# EAGLE design radio_module (EAGLE 6.5.0)
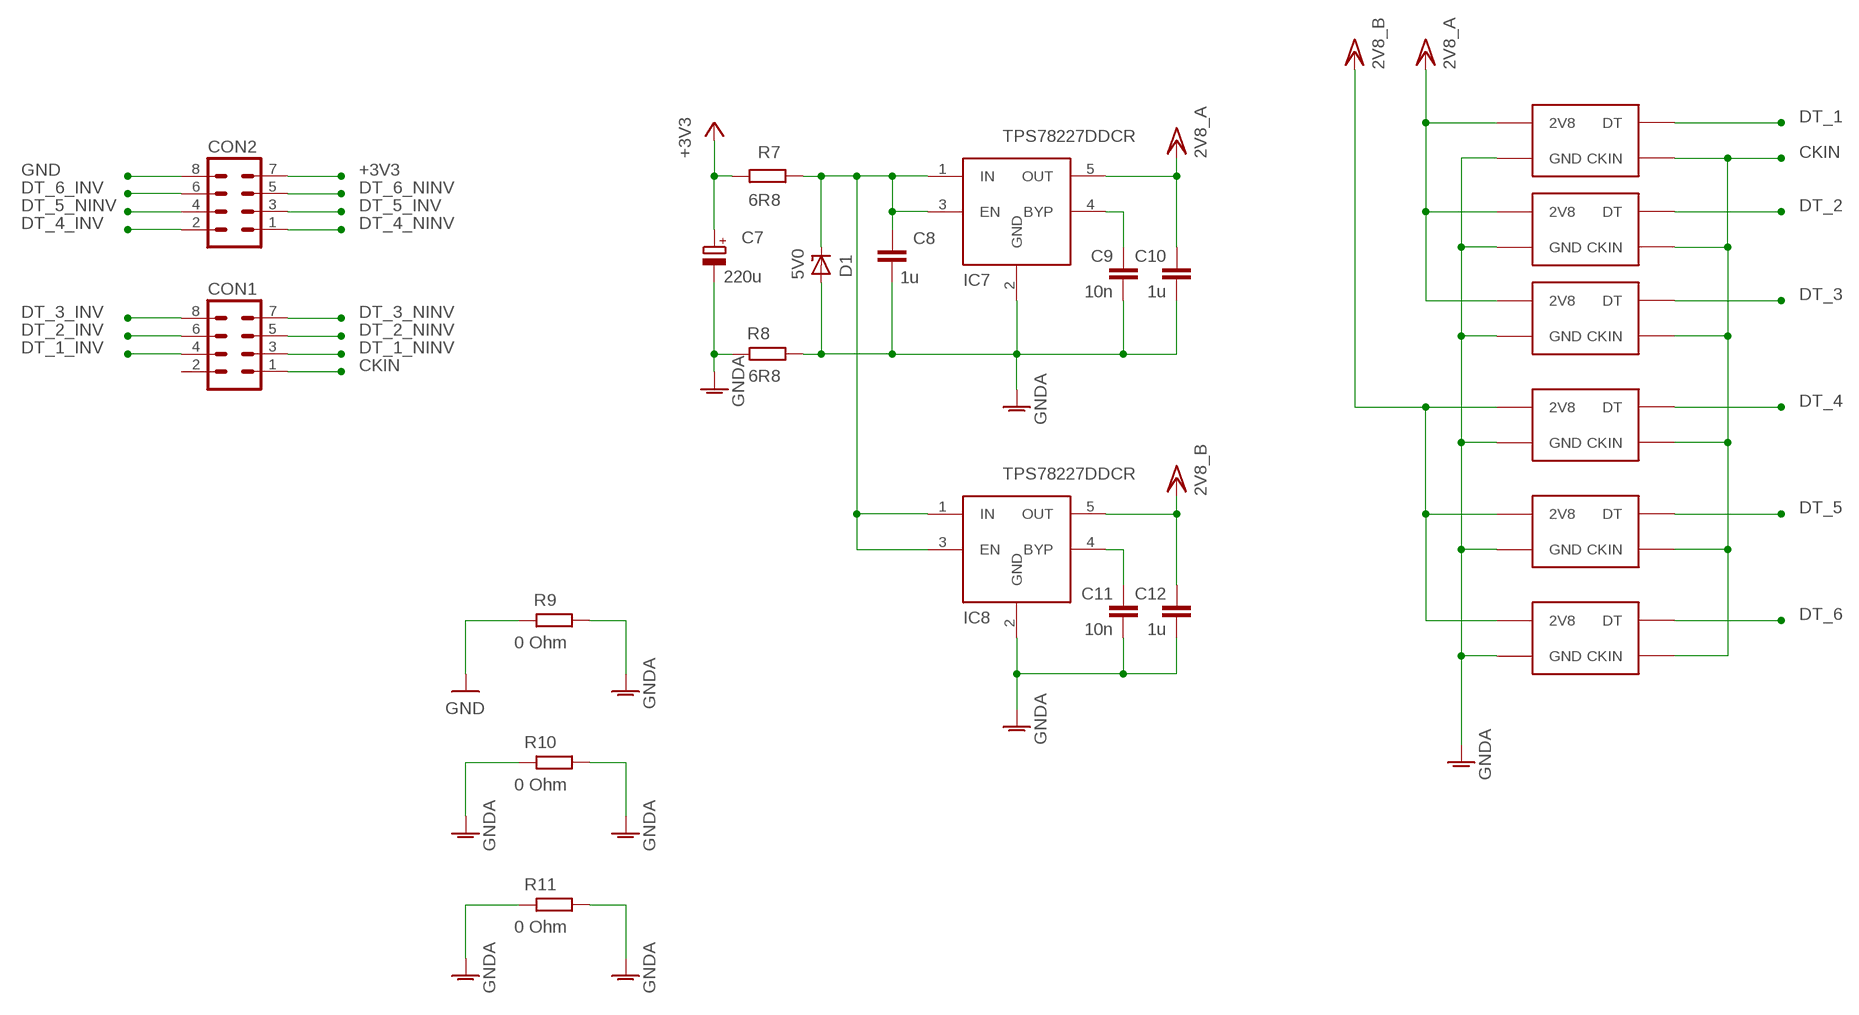
[diagram p0: schematic, sheet 1, part 1 of 2]
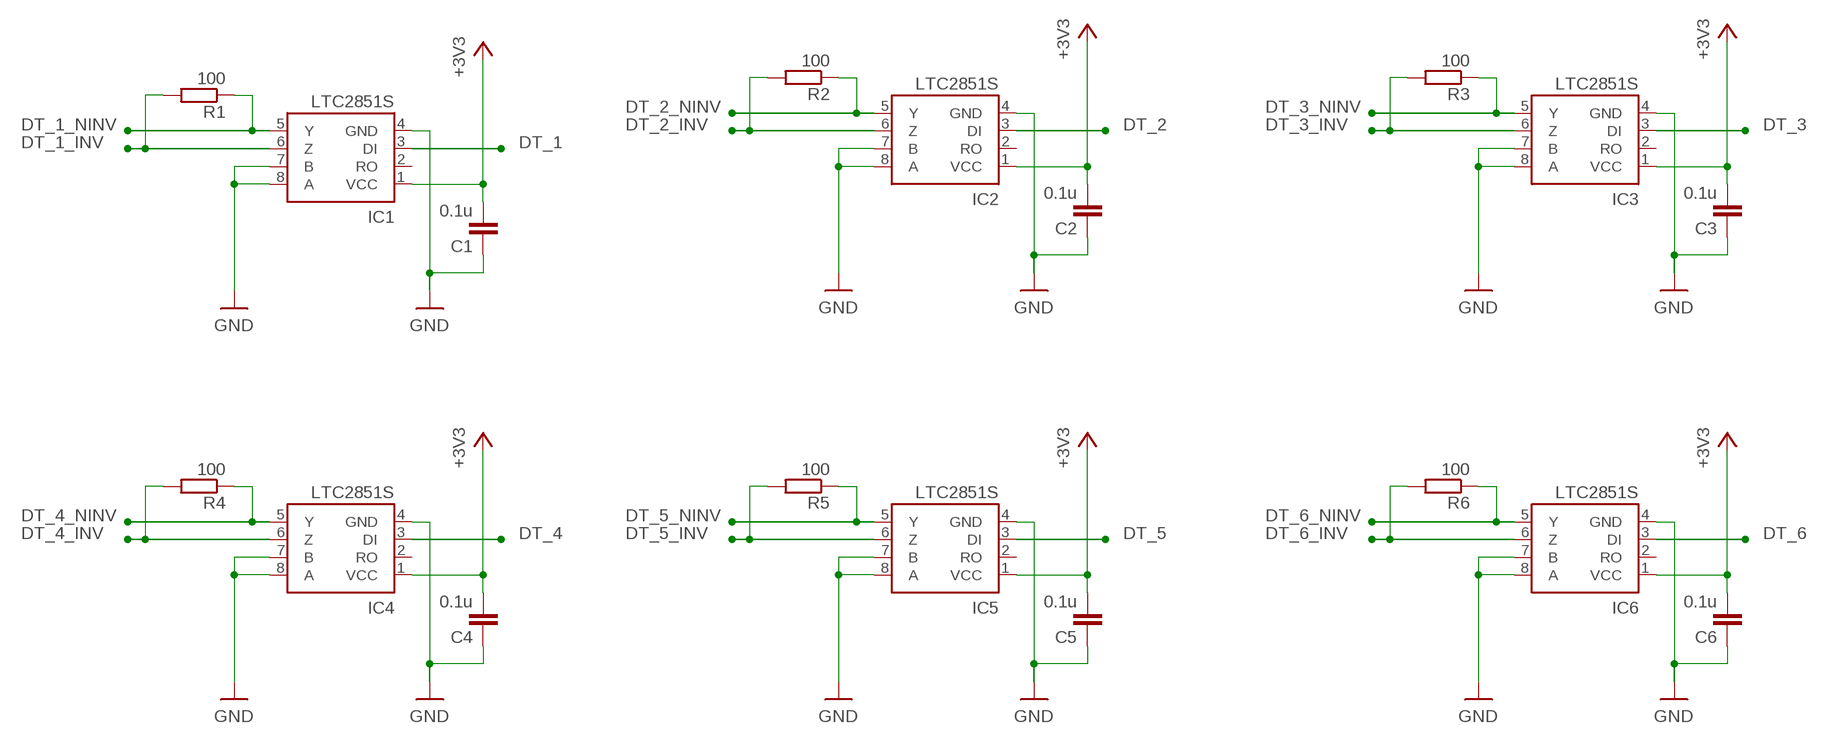
[diagram p1: schematic, sheet 1, part 2 of 2]

## Parts
C1  0.1u  C-EUC0805  [C0805]
C2  0.1u  C-EUC0805  [C0805]
C3  0.1u  C-EUC0805  [C0805]
C4  0.1u  C-EUC0805  [C0805]
C5  0.1u  C-EUC0805  [C0805]
C6  0.1u  C-EUC0805  [C0805]
C7  220u  CPOL-EU1210  [C1210]
C8  1u  C-EUC0603  [C0603]
C9  10n  C-EUC0603  [C0603]
C10  1u  C-EUC0603  [C0603]
C11  10n  C-EUC0603  [C0603]
C12  1u  C-EUC0603  [C0603]
CON1  MA04-2  [MA04-2]
CON2  MA04-2  [MA04-2]
D1  5V0  ZENER-DIODESOD523  [SOD523]
IC1  LTC2851S  [SOIC8]
IC2  LTC2851S  [SOIC8]
IC3  LTC2851S  [SOIC8]
IC4  LTC2851S  [SOIC8]
IC5  LTC2851S  [SOIC8]
IC6  LTC2851S  [SOIC8]
IC7  TPS78227DDCR  NCP700BSN  [SOT23-5]
IC8  TPS78227DDCR  NCP700BSN  [SOT23-5]
MOD_1  GPS_RADIO_MODULE  [GPS_RADIO_MODULE]
MOD_2  GPS_RADIO_MODULE  [GPS_RADIO_MODULE]
MOD_3  GPS_RADIO_MODULE  [GPS_RADIO_MODULE]
MOD_4  GPS_RADIO_MODULE  [GPS_RADIO_MODULE]
MOD_5  GPS_RADIO_MODULE  [GPS_RADIO_MODULE]
MOD_6  GPS_RADIO_MODULE  [GPS_RADIO_MODULE]
R1  100  R-EU_R0603  [R0603]
R2  100  R-EU_R0603  [R0603]
R3  100  R-EU_R0603  [R0603]
R4  100  R-EU_R0603  [R0603]
R5  100  R-EU_R0603  [R0603]
R6  100  R-EU_R0603  [R0603]
R7  6R8  R-EU_R0805  [R0805]
R8  6R8  R-EU_R0603  [R0603]
R9  0 Ohm  R-EU_R0805  [R0805]
R10  0 Ohm  R-EU_R0805  [R0805]
R11  0 Ohm  R-EU_R0805  [R0805]

## Nets
+2V8_A: C10.1 IC7.5(OUT) MOD_1.2V8@11(2V8) MOD_1.2V8@15(2V8) MOD_1.2V8@16(2V8) MOD_2.2V8@11(2V8) MOD_2.2V8@15(2V8) MOD_2.2V8@16(2V8) MOD_3.2V8@11(2V8) MOD_3.2V8@15(2V8) MOD_3.2V8@16(2V8) ; supply symbol labelled 2V8_A
+2V8_B: C12.1 IC8.5(OUT) MOD_4.2V8@11(2V8) MOD_4.2V8@15(2V8) MOD_4.2V8@16(2V8) MOD_5.2V8@11(2V8) MOD_5.2V8@15(2V8) MOD_5.2V8@16(2V8) MOD_6.2V8@11(2V8) MOD_6.2V8@15(2V8) MOD_6.2V8@16(2V8) ; supply symbol labelled 2V8_B
+3V3: C1.2 C2.2 C3.2 C4.2 C5.2 C6.2 C7.1(+) CON2.7 IC1.1(VCC) IC2.1(VCC) IC3.1(VCC) IC4.1(VCC) IC5.1(VCC) IC6.1(VCC) R7.2
BYP: C9.1 IC7.4(BYP)
BYP1: C11.1 IC8.4(BYP)
CKIN: CON1.1 MOD_1.CKIN@13(CKIN) MOD_2.CKIN@13(CKIN) MOD_3.CKIN@13(CKIN) MOD_4.CKIN@13(CKIN) MOD_5.CKIN@13(CKIN) MOD_6.CKIN@13(CKIN)
DT_1: IC1.3(DI) MOD_1.DT@12(DT)
DT_1_INV: CON1.4 IC1.6(Z) R1.2
DT_1_NINV: CON1.3 IC1.5(Y) R1.1
DT_2: IC2.3(DI) MOD_2.DT@12(DT)
DT_2_INV: CON1.6 IC2.6(Z) R2.2
DT_2_NINV: CON1.5 IC2.5(Y) R2.1
DT_3: IC3.3(DI) MOD_3.DT@12(DT)
DT_3_INV: CON1.8 IC3.6(Z) R3.2
DT_3_NINV: CON1.7 IC3.5(Y) R3.1
DT_4: IC4.3(DI) MOD_6.DT@12(DT)
DT_4_INV: CON2.2 IC4.6(Z) R4.2
DT_4_NINV: CON2.1 IC4.5(Y) R4.1
DT_5: IC5.3(DI) MOD_5.DT@12(DT)
DT_5_INV: CON2.3 IC5.6(Z) R5.2
DT_5_NINV: CON2.4 IC5.5(Y) R5.1
DT_6: IC6.3(DI) MOD_4.DT@12(DT)
DT_6_INV: CON2.6 IC6.6(Z) R6.2
DT_6_NINV: CON2.5 IC6.5(Y) R6.1
GND: C1.1 C2.1 C3.1 C4.1 C5.1 C6.1 CON2.8 IC1.4(GND) IC1.7(B) IC1.8(A) IC2.4(GND) IC2.7(B) IC2.8(A) IC3.4(GND) IC3.7(B) IC3.8(A) IC4.4(GND) IC4.7(B) IC4.8(A) IC5.4(GND) IC5.7(B) IC5.8(A) IC6.4(GND) IC6.7(B) IC6.8(A) R9.2
GNDA: C7.2(-) C8.2 C9.2 C10.2 C11.2 C12.2 D1.A IC7.2(GND) IC8.2(GND) MOD_1.GND@1(GND) MOD_1.GND@2(GND) MOD_1.GND@3(GND) MOD_1.GND@4(GND) MOD_1.GND@5(GND) MOD_1.GND@6(GND) MOD_1.GND@7(GND) MOD_1.GND@8(GND) MOD_1.GND@9(GND) MOD_1.GND@10(GND) MOD_1.GND@14(GND) MOD_1.V1(GND) MOD_1.V2(GND) MOD_1.V3(GND) MOD_1.V4(GND) MOD_1.V5(GND) MOD_1.V6(GND) MOD_1.V7(GND) MOD_1.V8(GND) MOD_1.V9(GND) MOD_1.V10(GND) MOD_1.V11(GND) MOD_1.V12(GND) MOD_1.V13(GND) MOD_1.V14(GND) MOD_1.V15(GND) MOD_1.V16(GND) MOD_1.V17(GND) MOD_1.V18(GND) MOD_1.V19(GND) MOD_1.V20(GND) MOD_1.V21(GND) MOD_1.V22(GND) MOD_1.V23(GND) MOD_1.V24(GND) MOD_1.V25(GND) MOD_1.V26(GND) MOD_1.V27(GND) MOD_1.V28(GND) MOD_1.V29(GND) MOD_1.V30(GND) MOD_2.GND@1(GND) MOD_2.GND@2(GND) MOD_2.GND@3(GND) MOD_2.GND@4(GND) MOD_2.GND@5(GND) MOD_2.GND@6(GND) MOD_2.GND@7(GND) MOD_2.GND@8(GND) MOD_2.GND@9(GND) MOD_2.GND@10(GND) MOD_2.GND@14(GND) MOD_2.V1(GND) MOD_2.V2(GND) MOD_2.V3(GND) MOD_2.V4(GND) MOD_2.V5(GND) MOD_2.V6(GND) MOD_2.V7(GND) MOD_2.V8(GND) MOD_2.V9(GND) MOD_2.V10(GND) MOD_2.V11(GND) MOD_2.V12(GND) MOD_2.V13(GND) MOD_2.V14(GND) MOD_2.V15(GND) MOD_2.V16(GND) MOD_2.V17(GND) MOD_2.V18(GND) MOD_2.V19(GND) MOD_2.V20(GND) MOD_2.V21(GND) MOD_2.V22(GND) MOD_2.V23(GND) MOD_2.V24(GND) MOD_2.V25(GND) MOD_2.V26(GND) MOD_2.V27(GND) MOD_2.V28(GND) MOD_2.V29(GND) MOD_2.V30(GND) MOD_3.GND@1(GND) MOD_3.GND@2(GND) MOD_3.GND@3(GND) MOD_3.GND@4(GND) MOD_3.GND@5(GND) MOD_3.GND@6(GND) MOD_3.GND@7(GND) MOD_3.GND@8(GND) MOD_3.GND@9(GND) MOD_3.GND@10(GND) MOD_3.GND@14(GND) MOD_3.V1(GND) MOD_3.V2(GND) MOD_3.V3(GND) MOD_3.V4(GND) MOD_3.V5(GND) MOD_3.V6(GND) MOD_3.V7(GND) MOD_3.V8(GND) MOD_3.V9(GND) MOD_3.V10(GND) MOD_3.V11(GND) MOD_3.V12(GND) MOD_3.V13(GND) MOD_3.V14(GND) MOD_3.V15(GND) MOD_3.V16(GND) MOD_3.V17(GND) MOD_3.V18(GND) MOD_3.V19(GND) MOD_3.V20(GND) MOD_3.V21(GND) MOD_3.V22(GND) MOD_3.V23(GND) MOD_3.V24(GND) MOD_3.V25(GND) MOD_3.V26(GND) MOD_3.V27(GND) MOD_3.V28(GND) MOD_3.V29(GND) MOD_3.V30(GND) MOD_4.GND@1(GND) MOD_4.GND@2(GND) MOD_4.GND@3(GND) MOD_4.GND@4(GND) MOD_4.GND@5(GND) MOD_4.GND@6(GND) MOD_4.GND@7(GND) MOD_4.GND@8(GND) MOD_4.GND@9(GND) MOD_4.GND@10(GND) MOD_4.GND@14(GND) MOD_4.V1(GND) MOD_4.V2(GND) MOD_4.V3(GND) MOD_4.V4(GND) MOD_4.V5(GND) MOD_4.V6(GND) MOD_4.V7(GND) MOD_4.V8(GND) MOD_4.V9(GND) MOD_4.V10(GND) MOD_4.V11(GND) MOD_4.V12(GND) MOD_4.V13(GND) MOD_4.V14(GND) MOD_4.V15(GND) MOD_4.V16(GND) MOD_4.V17(GND) MOD_4.V18(GND) MOD_4.V19(GND) MOD_4.V20(GND) MOD_4.V21(GND) MOD_4.V22(GND) MOD_4.V23(GND) MOD_4.V24(GND) MOD_4.V25(GND) MOD_4.V26(GND) MOD_4.V27(GND) MOD_4.V28(GND) MOD_4.V29(GND) MOD_4.V30(GND) MOD_5.GND@1(GND) MOD_5.GND@2(GND) MOD_5.GND@3(GND) MOD_5.GND@4(GND) MOD_5.GND@5(GND) MOD_5.GND@6(GND) MOD_5.GND@7(GND) MOD_5.GND@8(GND) MOD_5.GND@9(GND) MOD_5.GND@10(GND) MOD_5.GND@14(GND) MOD_5.V1(GND) MOD_5.V2(GND) MOD_5.V3(GND) MOD_5.V4(GND) MOD_5.V5(GND) MOD_5.V6(GND) MOD_5.V7(GND) MOD_5.V8(GND) MOD_5.V9(GND) MOD_5.V10(GND) MOD_5.V11(GND) MOD_5.V12(GND) MOD_5.V13(GND) MOD_5.V14(GND) MOD_5.V15(GND) MOD_5.V16(GND) MOD_5.V17(GND) MOD_5.V18(GND) MOD_5.V19(GND) MOD_5.V20(GND) MOD_5.V21(GND) MOD_5.V22(GND) MOD_5.V23(GND) MOD_5.V24(GND) MOD_5.V25(GND) MOD_5.V26(GND) MOD_5.V27(GND) MOD_5.V28(GND) MOD_5.V29(GND) MOD_5.V30(GND) MOD_6.GND@1(GND) MOD_6.GND@2(GND) MOD_6.GND@3(GND) MOD_6.GND@4(GND) MOD_6.GND@5(GND) MOD_6.GND@6(GND) MOD_6.GND@7(GND) MOD_6.GND@8(GND) MOD_6.GND@9(GND) MOD_6.GND@10(GND) MOD_6.GND@14(GND) MOD_6.V1(GND) MOD_6.V2(GND) MOD_6.V3(GND) MOD_6.V4(GND) MOD_6.V5(GND) MOD_6.V6(GND) MOD_6.V7(GND) MOD_6.V8(GND) MOD_6.V9(GND) MOD_6.V10(GND) MOD_6.V11(GND) MOD_6.V12(GND) MOD_6.V13(GND) MOD_6.V14(GND) MOD_6.V15(GND) MOD_6.V16(GND) MOD_6.V17(GND) MOD_6.V18(GND) MOD_6.V19(GND) MOD_6.V20(GND) MOD_6.V21(GND) MOD_6.V22(GND) MOD_6.V23(GND) MOD_6.V24(GND) MOD_6.V25(GND) MOD_6.V26(GND) MOD_6.V27(GND) MOD_6.V28(GND) MOD_6.V29(GND) MOD_6.V30(GND) R8.1 R8.2 R9.1 R10.1 R10.2 R11.1 R11.2
N$6: C8.1 D1.C IC7.1(IN) IC7.3(EN) IC8.1(IN) IC8.3(EN) R7.1
Unconnected: CON1.2 IC1.2(RO) IC2.2(RO) IC3.2(RO) IC4.2(RO) IC5.2(RO) IC6.2(RO)

## Library data of the parts
C1-C6 C8-C12 = rcl:C-EU: CAPACITOR, European symbol
C7 = rcl_1:CPOL-EU: POLARIZED CAPACITOR, European symbol
CON1 CON2 = con-lstb:MA04-2: PIN HEADER; OC_FARNELL: unknown; OC_NEWARK: unknown
D1 = diode1:ZENER-DIODE: Z-Diode
IC1-IC6 = texas_lvds:LTC2851: 3.3V 20Mbps RS485/RS422 Transceiver - Full Duplex no Enable Source: http://cds.linear.com/docs/Datasheet/285012fd.pdf
IC7 IC8 = on_ldo:NCP700B: NCP700B 200mA LDO Regulator
MOD_1-MOD_6 = radio_module:GPS_RADIO_MODULE
R1-R11 = rcl:R-EU_: RESISTOR, European symbol

## Board
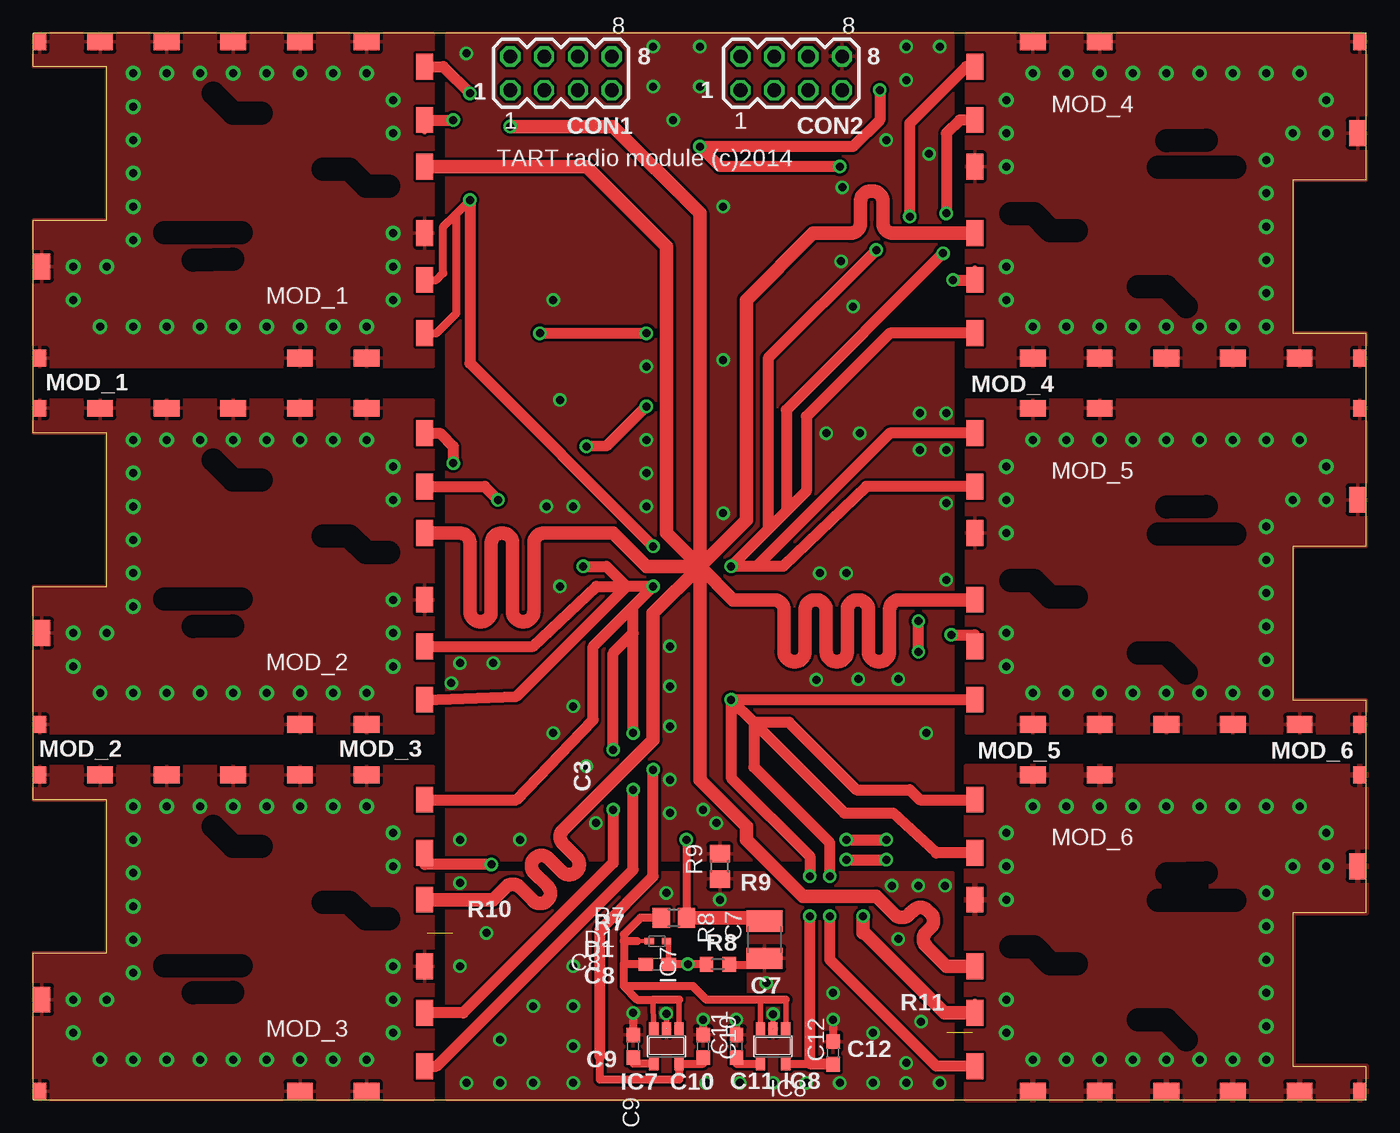
[diagram p2: board, top side]
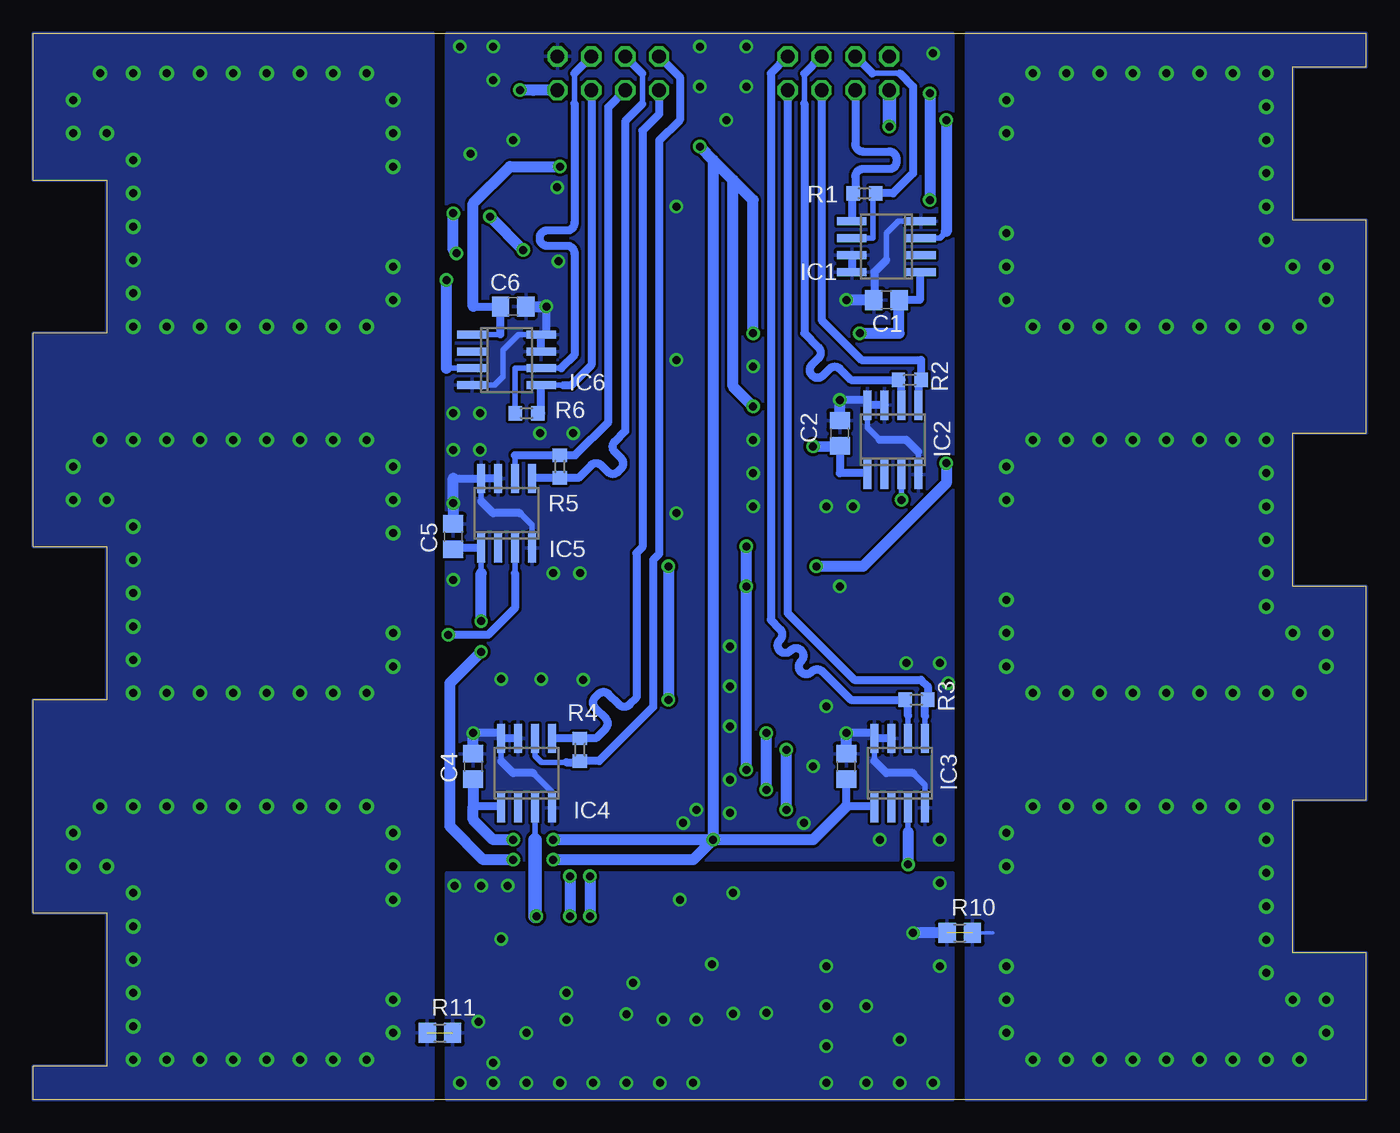
[diagram p3: board, bottom side, seen from below]

Size 100 x 80 mm. Coordinates in mm from the lower left corner, seen from the top.
Outline: 0,0 100,0 100,2.5 94.5,2.5 94.5,14 100,14 100,30 94.5,30 94.5,41.5 100,41.5 100,57.5 94.5,57.5 94.5,69 100,69 100,80 0,80 0,77.5 5.5,77.5 5.5,66 0,66 0,50 5.5,50 5.5,38.5 0,38.5 0,22.5 5.5,22.5 5.5,11 0,11 0,0
Copper layers (1*16): Top 0.035mm / dielectric 1.5mm / Bottom 0.035mm
Design rules "default *": minimum track width 10mil, minimum drill 0.6mm, track to track 8mil, track to pad 8mil, pad to pad 8mil, via to via 8mil, smd to smd 8mil, copper to edge 0mil, drill to drill 8mil, minimum pad ring 10mil, minimum via ring 8mil, stop-mask expansion 4mil, vias tented up to drill 0mil, thermal gap 10mil
tRestrict: area 44.5,7.8 to 53.5,13.2

### Footprints (pad centres in the part's own frame; a part is rotated, then mirrored left to right if it is on the bottom)
C0805 = smd 1.3 x 1.5: 1 -0.95,0; 2 0.95,0
C1210 = smd 1.6 x 2.7: 1 -1.4,0; 2 1.4,0
C0603 = smd 1.1 x 1: 1 -0.85,0; 2 0.85,0
MA04-2 = drill 1.016 octagon: 1 -3.81,-1.27; 2 -3.81,1.27; 3 -1.27,-1.27; 4 -1.27,1.27; 5 1.27,-1.27; 6 1.27,1.27; 7 3.81,-1.27; 8 3.81,1.27
SOD523 = smd 0.7 x 0.5: A 0.7,0; C -0.6,0
SOIC8 = smd 0.6 x 2.2: 1 -1.905,-2.6; 2 -0.635,-2.6; 3 0.635,-2.6; 4 1.905,-2.6; 5 1.905,2.6; 6 0.635,2.6; 7 -0.635,2.6; 8 -1.905,2.6
SOT23-5 = smd 0.69 x 0.99: 1 -0.95,-1.29; 2 0,-1.29; 3 0.95,-1.29; 4 0.95,1.3; 5 -0.95,1.3
GPS_RADIO_MODULE = smd 1.27 x 1.93: 2V8@11 0.635,2.5; 2V8@15 0.635,18.5; 2V8@16 0.635,22.5; CKIN@13 0.635,10; DT@12 0.635,6.5; GND@4 29.365,17.5; GND@14 0.635,15 | smd 1.93 x 1.27: GND@1 5,24.365; GND@2 10,24.365; GND@6 25,0.635; GND@7 20,0.635; GND@8 15,0.635; GND@9 10,0.635; GND@10 5,0.635 | smd 0.965 x 1.27: GND@3 29.517,24.365; GND@5 29.517,0.635 | drill 0.6: V1 5,22; V2 7.5,22; V3 10,22; V4 12.5,22; V5 15,22; V6 17.5,22; V7 20,22; V8 22.5,22; V9 25,22; V10 27,20; V11 27,17.5; V12 24.5,17.5; V13 22.5,15.5; V14 22.5,13; V15 22.5,10.5; V16 22.5,8; V17 22.5,5.5; V18 22.5,3; V19 20,3; V20 17.5,3; V21 15,3; V22 12.5,3; V23 10,3; V24 7.5,3; V25 5,3; V26 3,5; V27 3,7.5; V28 3,15; V29 3,17.5; V30 3,20
R0603 = smd 1 x 1.1: 1 -0.85,0; 2 0.85,0
R0805 = smd 1.3 x 1.5: 1 -0.95,0; 2 0.95,0

### Placement (x,y rotation side)
C1  36,60 0 bottom
C2  39.5,50 270 bottom
C3  39,25 270 bottom
C4  67,25 270 bottom
C5  68.5,42.25 270 bottom
C6  64,59.5 180 bottom
C7  54.86,12 270 top
C8  46.8,10.15 0 top
C9  45,4 90 top
C10  50.25,4 90 top
C11  52.75,4 90 top
C12  60,3.5 90 top
CON1  39.59,77 0 top
CON2  56.87,77 0 top
D1  46.8,11.9 0 top
IC1  36,64 90 bottom
IC2  35.5,49.5 0 bottom
IC3  35,24.5 0 bottom
IC4  63,24.5 0 bottom
IC5  64.5,44 0 bottom
IC6  64.5,55.5 270 bottom
IC7  47.5,4 180 top
IC8  55.5,4 180 top
MOD_1  30,80 180 top
MOD_2  30,52.5 180 top
MOD_3  30,25 180 top
MOD_4  70,55 0 top
MOD_5  70,27.5 0 top
MOD_6  70,0 0 top
R1  37.65,68 0 bottom
R2  34.25,53.99 180 bottom
R3  33.75,29.99 180 bottom
R4  58.99,26.25 270 bottom
R5  60.5,47.5 90 bottom
R6  63,51.5 180 bottom
R7  48.05,13.65 0 top
R8  51.35,10.15 180 top
R9  51.5,17.5 90 top
R10  30.5,12.5 0 bottom
R11  69.5,5 0 bottom

### Tracks (layer width: path | path; a pad name or v marks a point on that pad's centre or on a via)
+2V8_A  (via drill 0.6)
  Top 0.61: C10.1 50.25,2.7 IC7.5 48.45,1.5 42.5,1.5 42.5,3.25 | MOD_1.2V8@16 30.25,57.5 31.75,59 31.75,66.25 31.62,66.38 | MOD_1.2V8@15 30.25,61.5 30.75,62 30.75,65.5 31.62,66.38 | 31.62,66.38 v32.75,67.5
  Top 0.813: MOD_2.2V8@11 30.5,50 31.5,49 v31.5,47.75 | MOD_1.2V8@11 30.75,77.5 v32.75,75.5 | MOD_2.2V8@15 37.5,34 42.25,38.5 44.5,38.5 | 42.5,3.25 42.5,12.75 46.5,16.75 v46.5,24.75 | MOD_3.2V8@15 32.25,6.5 43.5,17.75 v43.5,21.75 | v32.75,67.5 32.75,55.25 v46.5,41.5 | v41.25,40 43,40 44.5,38.5 | MOD_2.2V8@16 36.25,30.25 44.5,38.5 | MOD_3.2V8@11 36.25,22.5 42,28.5 42,34 45,37 | 44.5,38.5 v46.5,38.5 45,37 | v43.5,26.25 43.5,33.5 45,35 | 45,35 45,37 | v45,27.5 45,35 | v45,23.25 45,17.25 30.25,2.5 MOD_3.2V8@16
  Bottom 0.813: v41.25,40 37.75,40 31.5,46.25 v31.5,47.75 | v32.75,75.5 v32.75,67.5 | v43.5,21.75 v43.5,26.25 | v46.5,24.75 v46.5,38.5 v46.5,41.5 | v45,23.25 v45,27.5
+2V8_B  (via drill 0.6)
  Top 0.61: IC8.5 58.25,2.7
  Top 0.813: MOD_4.2V8@11 64.25,57.5 58,51.25 58,45.65 56.5,44.15 | MOD_5.2V8@16 64.25,50 54.25,40 | 54.25,40 v52.35,40 55.12,42.77 | MOD_5.2V8@15 62.5,46 56.25,40 54.25,40 | MOD_4.2V8@15 69.5,73.5 68.5,72.5 v68.5,66.5 | v65.75,66.25 65.75,73.25 70,77.5 MOD_4.2V8@16 | v63.25,63.75 55.12,55.62 55.12,42.77 | v68.25,63.5 56.5,51.75 56.5,44.15 | MOD_5.2V8@11 v52.35,30 | MOD_6.2V8@15 67.75,18.5 64.5,21.5 60.85,21.5 54.05,28.3 | MOD_6.2V8@11 67.75,2.5 59.75,10.5 v59.75,13.75 | MOD_6.2V8@16 66.5,22.5 65.75,23.25 61.75,23.25 56.7,28.3 54.05,28.3 | v52.35,30 52.35,24.15 58.25,18.25 v58.25,16.75 | 56.5,44.15 55.12,42.77 | v52.35,30 54.05,28.3 | 54.05,28.3 54.05,24.95 59.75,19.25 v59.75,16.75 | v58.25,13.75 58.25,2.7 60,2.7 C12.1
  Bottom 0.813: v52.35,40 v52.35,30 | v65.75,66.25 v63.25,63.75 | v68.25,63.5 68.5,63.75 v68.5,66.5 | v59.75,16.75 v59.75,13.75 | v58.25,16.75 v58.25,13.75
+3V3  (via drill 0.6)
  Top 0.61: v49,19.5 R7.2
  Top 0.813: v61,19.5 v64,19.5 | v38,57.5 v46,57.5 | v46,52 46,52.05 43,49.05 v41.5,49 | v60.5,70 51.5,70 v50,71.5 61.5,71.5 63.5,73.5 v63.5,75.75 | v66.41,33.59 v66.41,35.9 | v61,18 v64,18
  Top 1.016: R7.2 54.86,13.65 C7.1
  Bottom 0.406: IC6.1 64.95,57.41 | 66.41,39.5 IC5.1
  Bottom 0.61: IC4.1 64.91,22 67,22 | 66.41,41.5 IC5.1 68.5,41.4 C5.2 | IC6.1 67,57.41 | 67,59.5 C6.2 64.95,57.41 | IC1.1 33.5,62.09 33.5,60 C1.2 | IC2.1 37.41,47 39.5,47 C2.2 | IC3.1 36.91,22 39,22 C3.2
  Bottom 0.813: v50,71.5 49,70.5 | 49,70.5 v49,19.5 | v64,19.5 65.5,19.5 67,21 67,22 C4.2 | v38,57.5 35.05,57.5 C1.2 | v41.5,49 C2.2 | 39,22 41.5,19.5 v49,19.5 | v49,19.5 v61,19.5 | v46,57.5 46,67.5 47.5,69 | 47.5,69 49,70.5 | v46,52 47.5,53.5 47.5,69 | 67,59.5 67,67.25 64.25,70 v60.5,70 | v66.41,33.59 68.75,31.25 68.75,20.5 66.25,18 v64,18 | v66.41,35.9 66.41,39.5 | v61,18 50.5,18 v49,19.5 | CON2.7 62.5,75.73 62.5,75.75 v63.5,75.75
BYP
  Top 0.61: IC7.4 45,2.7 C9.1
BYP1
  Top 0.61: C11.1 52.75,2.7 IC8.4
CKIN  (via drill 0.6 pad 0.61)
  Top 1.016: MOD_3.CKIN@13 34.5,15 35.42,15.93 arc-90 36.5,15.93 37.5,14.93 arc90 38.57,14.93 38.58,14.94 arc90 38.58,16.01 37.59,17.01 arc-90 37.59,18.09 37.59,18.09 arc-90 38.67,18.09 39.66,17.09 arc90 40.74,17.09 40.74,17.1 arc90 40.74,18.18 39.75,19.17 arc-90 39.75,20.25 46.5,27 46.5,36.5 50,40 | v35.78,73 43.5,73 50,66.5 50,40 | MOD_5.CKIN@13 65,37.5 arc90 64.24,36.74 64.24,33.61 arc-90 63.48,32.85 63.42,32.85 arc-90 62.65,33.61 62.65,36.74 arc90 61.89,37.5 61.83,37.5 arc90 61.07,36.74 61.07,33.61 arc-90 60.31,32.85 60.25,32.85 arc-90 59.48,33.61 59.48,36.74 arc90 58.72,37.5 58.66,37.5 arc90 57.9,36.74 57.9,33.61 arc-90 57.14,32.85 57.08,32.85 arc-90 56.32,33.61 56.32,36.74 arc90 55.55,37.5 52.5,37.5 50,40 | MOD_1.CKIN@13 41.5,70 47.5,64 47.5,42.5 50,40 | MOD_2.CKIN@13 32,42.5 arc-90 32.76,41.74 32.76,36.61 arc90 33.52,35.85 33.6,35.85 arc90 34.36,36.61 34.36,41.74 arc-90 35.12,42.5 35.19,42.5 arc-90 35.95,41.74 35.95,36.61 arc90 36.72,35.85 36.79,35.85 arc90 37.55,36.61 37.55,41.74 arc-90 38.31,42.5 43.5,42.5 46,40 50,40 | MOD_4.CKIN@13 64.5,65 arc-90 63.74,65.76 63.74,67.39 arc90 62.98,68.16 62.82,68.16 arc90 62.06,67.39 62.06,65.76 arc-90 61.3,65 58.5,65 53.5,60 53.5,43.5 50,40 | 50,40 50,24 53.5,20.5 53.5,19.5 57.75,15.25 63.25,15.25 64.62,13.88 arc90 65.7,13.88 66.02,14.2 arc-90 67.1,14.2 67.32,13.97 arc-90 67.32,12.9 67,12.58 arc90 67,11.5 68.5,10 MOD_6.CKIN@13
  Bottom 1.016: CON1.1 v35.78,73
DT_1  (via drill 0.6 pad 0.61)
  Top 0.406: 29.36,72.64 MOD_1.DT@12
  Top 0.813: MOD_1.DT@12 v31.5,73.5
  Bottom 0.406: 31.5,65.14 32,64.64 IC1.3
  Bottom 0.813: v31.5,73.5 31.5,65.14
DT_1_INV
  Bottom 0.406: IC1.6 37,64.64 37,68 R1.2 | 37.05,77 34.99,77
  Bottom 0.61: CON1.4 37.05,77 | 34.99,77 34,76 34,69.5 35.5,68 R1.2
DT_1_NINV
  Bottom 0.61: 38.33,65.91 IC1.5 38.6,68 R1.1 38.33,68 38.33,69.25 arc90 37.77,69.81 35.8,69.81 arc-90 35.24,70.37 35.24,70.57 arc-90 35.8,71.13 37.77,71.13 arc90 38.33,71.69 CON1.3
DT_2  (via drill 0.6)
  Top 0.813: MOD_2.DT@12 33.87,46 v34.87,45
  Bottom 0.406: IC2.3 v34.87,45
DT_2_INV
  Bottom 0.406: 42.15,74.73 42.15,76.98
  Bottom 0.61: IC2.6 34.87,53.99 R2.2 38.65,53.99 39.48,54.82 arc-90 40.27,54.82 40.77,54.32 arc90 41.55,54.32 41.58,54.34 arc90 41.58,55.13 41.08,55.63 arc-90 41.08,56.42 42.15,57.49 42.15,74.73 | 42.15,76.98 CON1.6
DT_2_NINV
  Bottom 0.61: IC2.5 33.59,53.99 R2.1 33.4,55.5 37.87,55.5 40.87,58.5 CON1.5
DT_3  (via drill 0.6)
  Top 0.406: 29.36,17.64 MOD_3.DT@12
  Top 0.813: v34.37,17.64 29.36,17.64
  Bottom 0.406: IC3.3 34.37,20.05
  Bottom 0.813: 34.37,20.05 v34.37,17.64
DT_3_INV
  Bottom 0.406: IC3.6 34.37,28.8
  Bottom 0.61: 34.37,28.8 34.37,29.99 R3.2 38.67,29.99 40.79,32.11 arc-90 41.58,32.11 41.61,32.08 arc90 42.4,32.08 42.4,32.09 arc90 42.4,32.88 42.38,32.9 arc-90 42.38,33.69 42.38,33.7 arc-90 43.17,33.7 43.2,33.67 arc90 43.99,33.67 43.99,33.68 arc90 43.99,34.47 43.97,34.49 arc-90 43.97,35.28 44.67,35.99 44.67,77 CON1.8
DT_3_NINV
  Bottom 0.406: IC3.5 33.09,28.75
  Bottom 0.61: 33.09,28.75 33.09,29.99 R3.1 32.9,31 33.4,31.5 38.41,31.5 43.41,36.5 CON1.7
DT_4  (via drill 0.6)
  Top 0.406: 70.64,7.37 MOD_6.DT@12
  Top 1.016: MOD_6.DT@12 68.36,6.5 62.37,12.5 62.25,12.5 v62.25,13.75
  Bottom 0.406: IC4.3 62.37,19.5
  Bottom 1.016: v62.25,13.75 62.37,13.75 62.37,19.5
DT_4_INV
  Bottom 0.406: 60,25.3 61.87,25.3 62.37,25.8 IC4.6
  Bottom 0.61: 60,25.3 58.99,25.3 R4.2 57.55,25.4 53.5,29.45 53.5,40.5 53.05,40.95 53.05,71.94 51.5,73.5 51.5,76.72 CON2.2
DT_4_NINV
  Bottom 0.61: IC4.5 R4.1 57.8,27.1 57.08,27.82 arc-90 57.08,28.61 57.85,29.39 arc90 57.85,30.18 57.62,30.41 arc90 56.83,30.41 56.06,29.63 arc-90 55.27,29.63 54.75,30.15 54.75,41 54.3,41.45 54.3,72.7 53.05,73.94 CON2.1
DT_5  (via drill 0.6)
  Top 0.406: 70.64,34.87 MOD_5.DT@12
  Top 0.813: v68.86,34.87 70.64,34.87
  Bottom 0.406: 63.87,39.5 IC5.3
  Bottom 0.61: 63.87,39.5 63.87,36.87 65.86,34.87 v68.86,34.87
DT_5_INV
  Bottom 0.406: 63.87,48.35 IC5.6
  Bottom 0.61: 63.87,48.35 R5.2 59.35,48.35 56.85,50.85 56.85,74.47 CON2.3
DT_5_NINV
  Bottom 0.406: 54.3,74.7 54.3,76.97
  Bottom 0.61: IC5.5 62.59,46.65 R5.1 59.1,46.65 58.17,47.58 arc90 57.38,47.58 56.91,47.11 arc-90 56.12,47.11 55.91,47.33 arc-90 55.91,48.12 56.38,48.59 arc90 56.38,49.38 55.6,50.15 55.6,73.4 54.3,74.7 | 54.3,76.97 CON2.4
DT_6  (via drill 0.6)
  Top 0.406: 70.64,62.37 MOD_4.DT@12
  Top 0.813: v69,61.5 MOD_4.DT@12
  Bottom 0.406: IC6.3 69,54.87
  Bottom 0.813: 69,54.87 v69,61.5
DT_6_INV
  Bottom 0.406: R6.2 63.85,54.87 IC6.6 60.4,54.87 | 59.4,74.75 59.4,77
  Bottom 0.61: 60.4,54.87 59.4,55.87 59.4,63.5 arc-90 59.96,64.06 61.45,64.06 arc90 62.01,64.62 62.01,64.65 arc90 61.45,65.21 59.96,65.21 arc-90 59.4,65.77 59.4,74.75 | 59.4,77 CON2.6
DT_6_NINV
  Bottom 0.406: IC6.5 60.25,53.59
  Bottom 0.61: 60.25,53.59 59.63,53.59 58.13,55.09 CON2.5 | R6.1 61.9,51.5 IC6.5
GND  (via drill 0.6)
  Bottom 0.406: IC1.4 35.09,65.91 36,65 36,63 | 36.91,60 C1.1 | IC2.4 33.59,48.59 | IC3.4 33.09,23.59 34,24.5 | IC6.4 65.41,53.59 64.75,54.25 64.75,56.25 63.59,57.41 IC6.8 | 66.41,44.91 IC5.8 | 61.09,23.09 62.5,24.5 | 64.91,25.41 IC4.8 | IC5.4 62.59,43.09 63.5,44 | 36.5,49.5 37.41,50.41 IC2.8 | 36.91,25.41 IC3.8 36.91,27.5
  Bottom 0.61: IC1.7 IC1.8 39,62.09 | 36,63 36.91,62.09 36.91,60 | IC2.7 IC2.8 | 33.59,48.59 34.5,49.5 36.5,49.5 | 37.41,52.5 v39.5,52.5 | IC3.7 IC3.8 | 36.91,27.5 v39,27.5 | 34,24.5 36,24.5 36.91,25.41 | 61.5,57.41 v61.5,59.5 | IC6.7 IC6.8 | 63.5,44 65.5,44 66.41,44.91 | IC5.7 IC5.8 | IC5.8 66.41,47 | 68.5,46.6 IC5.8 | 62.5,24.5 64,24.5 64.91,25.41 | IC4.7 IC4.8 64.91,27.5 v67,27.5
  Bottom 0.813: C2.1 v39.5,52.5 | C3.1 v39,27.5 | C6.1 v61.5,59.5 | C5.1 v68.5,44.75 68.5,46.6 | C4.1 v67,27.5 | 36.91,60 v39,60
  other vias: 32,32.75 34.5,32.75 47.75,34 47.75,31 47.75,28 47.75,24 47.75,21.5 58.75,31.5 61.9,31.55 68.5,39 61,39.5 59,39.5 66.5,51.5 68.5,48.75 66.5,48.75 68.5,51.5 60.6,62.9 60.7,68.45 67.2,70.95 68,79 48,73.5 32.5,78.5 46,55 40.5,44.5 38.5,44.5 36.5,19.5 32,19.5 42.2,20.75 41.5,25 31.35,31.25 50.25,21.75 51.25,20.75 46,49.5 46,47 46,44.5 51.75,44 51.75,55.5 51.75,67 64.9,31.55 59.5,50 62,50 65.5,79 65.5,76.5 64,72 46.5,79 50,79 46.5,76 50,76 39.5,38.5 40.5,29.5
  pour Bottom: 31,80 69,80 69,18 31,18
  pour Top: 31,18 69,18 69,80 31,80
GNDA  (via drill 0.6, 0.6 pad 0.25)  (2 unrouted)
  Top 0.406: v47.5,6.45 IC7.2 | v55.5,6.4 IC8.2 | D1.A 47.65,11.9 C8.2
  Top 0.61: v50.25,6 C10.2 | v45,6.5 C9.2 | v60,6 C12.2 | R8.1 52.25,10.1 54.86,10.1 C7.2 | C11.2 v52.75,6 | R8.2 v49.1,10.15 C8.2
  Bottom 0.254: 28,12.5 29,12.5
  Bottom 0.813: R10.1 v34,12.5
  other vias: 66.6,5.85 32.5,1.25 35,1.25 37.5,1.25 40.5,1.25 68.4,16.05 66.4,16.05 64.4,16.05 64.9,12.05 32,10 32,16.25 40.5,4 40.5,7 40.5,10 35,4.5 37.5,7 63,5 60,8 50.5,1.25 53,1.25 55.5,1.25 58,1.25 60.5,1.25 63,1.25 65.5,1.25 65.5,2.75 68,1.25 51.5,15 55,8.75 47.5,15.5
  pour Top: 70,25 100,25 100,14 94.5,14 94.5,2.5 100,2.5 100,0 70,0
  pour Top: 0,55 30,55 30,80 0,80 0,77.5 5.5,77.5 5.5,66 0,66
  pour Top: 0,27.5 30,27.5 30,52.5 0,52.5 0,50 5.5,50 5.5,38.5 0,38.5
  pour Top: 0,25 30,25 30,0 0,0 0,11 5.5,11 5.5,22.5 0,22.5
  pour Top: 70,27.5 100,27.5 100,30 94.5,30 94.5,41.5 100,41.5 100,52.5 70,52.5
  pour Top: 70,55 100,55 100,57.5 94.5,57.5 94.5,69 100,69 100,80 70,80
  pour Bottom: 70,0 100,0 100,2.5 94.5,2.5 94.5,14 100,14 100,30 94.5,30 94.5,41.5 100,41.5 100,57.5 94.5,57.5 94.5,69 100,69 100,80 70,80
  pour Bottom: 0,22.5 0,38.5 5.5,38.5 5.5,50 0,50 0,66 5.5,66 5.5,77.5 0,77.5 0,80 30,80 30,0 0,0 0,11 5.5,11 5.5,22.5
  pour Bottom: 31,0 69,0 69,17 31,17
  pour Top: 31,0 69,0 69,17 31,17
N$6
  Top 0.305: 45.3,11.9 D1.C
  Top 0.406: IC7.1 48.45,7.5 | IC7.3 46.5,6.79 46.5,7.5 | IC8.1 56.45,7.5 | IC8.3 54.55,7.5
  Top 0.61: C8.1 44.3,10.15 | R7.1 45.55,13.65 44.3,12.4 44.3,11.9 | 44.3,11.9 44.3,10.15 | 44.3,11.9 45.3,11.9 | 48.45,7.5 46.5,7.5 45.3,7.5 44.3,8.5 | 44.3,8.5 44.3,10.15 | 56.45,7.5 54.55,7.5 50.5,7.5 49.5,8.5 44.3,8.5

### Text on the board
_tsilk: 8 | 8 | 1 | 1 | CON1 | CON2 | TART radio module (c)2014 | MOD_1 | MOD_4 | MOD_2 | MOD_3 | MOD_5 | MOD_6 | C3 | R9 | R10 | R7 | R8 | D1 | C8 | C7 | R11 | C9 | C12 | IC7 | C10 | C11 | IC8
_bsilk: R1 | IC1 | C6 | C1 | R2 | IC6 | C2 | R6 | IC2 | R5 | C5 | IC5 | R4 | R3 | C4 | IC3 | IC4